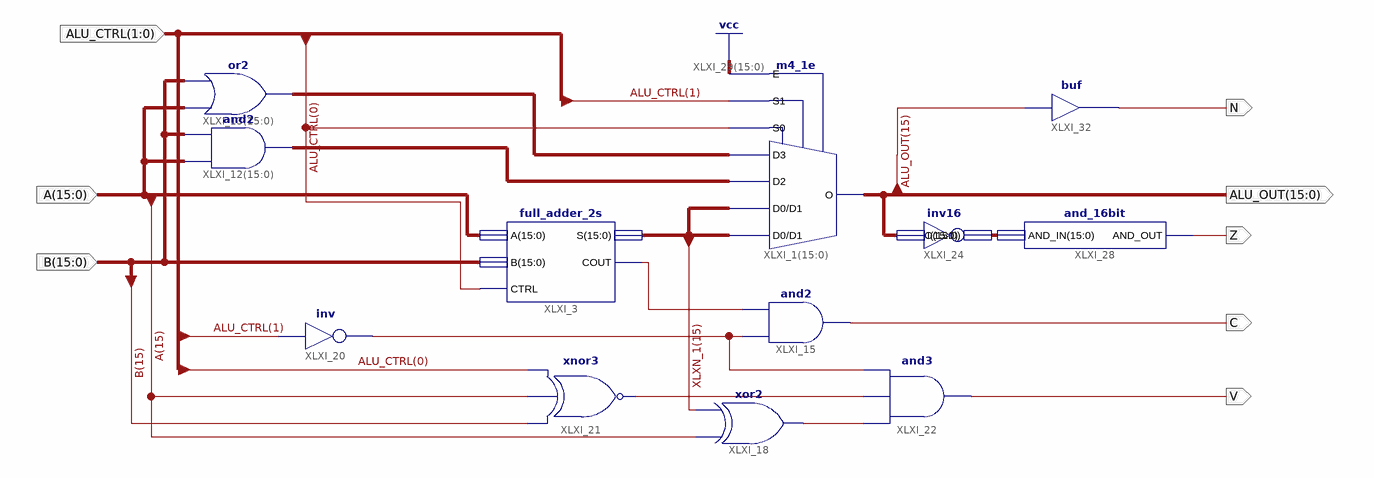
[diagram p0: schematic sheet 1]
// Xilinx ISE schematic alu_16bit.sch (spartan6) as structural Verilog: 12 symbols, 8 ports
module alu_16bit (
  input  [15:0] B,
  input  [15:0] A,
  input  [1:0] ALU_CTRL,
  output C,
  output V,
  output [15:0] ALU_OUT,
  output Z,
  output N
);

  wire XLXN_41, XLXN_71, XLXN_72, XLXN_74;
  wire [15:0] XLXN_1, XLXN_25, XLXN_27, XLXN_87;

  full_adder_2s XLXI_3 (.A(A), .B(B), .COUT(XLXN_41), .CTRL(ALU_CTRL[0]), .S(XLXN_1));
  m4_1e XLXI_1[15:0] (
    .D0(XLXN_1), .D1(XLXN_1), .D2(XLXN_25), .D3(XLXN_27), .E({16{1'b1}}), .S0(ALU_CTRL[0]), .S1(ALU_CTRL[1]),
    .O(ALU_OUT));
  assign XLXN_25 = A & B;  // and2 XLXI_12[15..0], 16 bits wide
  assign XLXN_27 = A | B;  // or2 XLXI_13[15..0], 16 bits wide
  and XLXI_15 (C, XLXN_74, XLXN_41);
  xor XLXI_18 (XLXN_72, A[15], XLXN_1[15]);
  not XLXI_20 (XLXN_74, ALU_CTRL[1]);
  xnor XLXI_21 (XLXN_71, B[15], A[15], ALU_CTRL[0]);
  and XLXI_22 (V, XLXN_72, XLXN_71, XLXN_74);
  inv16 XLXI_24 (.I(ALU_OUT), .O(XLXN_87));
  and_16bit XLXI_28 (.AND_IN(XLXN_87), .AND_OUT(Z));
  buf XLXI_32 (N, ALU_OUT[15]);
endmodule
